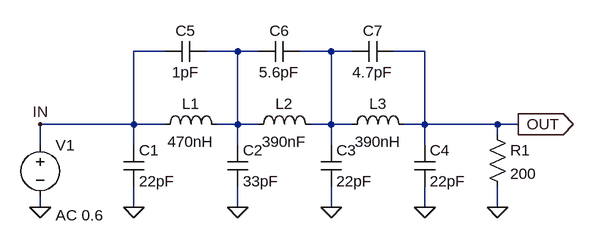
[diagram p0: schematic AD8933_3rdLPF.asc]
AD8933_3rdLPF.asc, the LTspice schematic file:
Version 4
SHEET 1 980 680
WIRE 320 0 272 0
WIRE 432 0 384 0
WIRE 464 0 432 0
WIRE 576 0 528 0
WIRE 608 0 576 0
WIRE 720 0 672 0
WIRE 272 112 272 0
WIRE 272 112 128 112
WIRE 320 112 272 112
WIRE 432 112 432 0
WIRE 432 112 400 112
WIRE 464 112 432 112
WIRE 576 112 576 0
WIRE 576 112 544 112
WIRE 608 112 576 112
WIRE 720 112 720 0
WIRE 720 112 688 112
WIRE 832 112 720 112
WIRE 864 112 832 112
WIRE 832 128 832 112
WIRE 128 144 128 112
WIRE 272 144 272 112
WIRE 432 144 432 112
WIRE 576 144 576 112
WIRE 720 144 720 112
WIRE 128 240 128 224
WIRE 272 240 272 208
WIRE 432 240 432 208
WIRE 576 240 576 208
WIRE 720 240 720 208
WIRE 832 240 832 208
FLAG 128 240 0
FLAG 272 240 0
FLAG 432 240 0
FLAG 576 240 0
FLAG 720 240 0
FLAG 832 240 0
FLAG 864 112 OUT
IOPIN 864 112 Out
FLAG 128 112 IN
SYMBOL voltage 128 128 R0
WINDOW 123 24 124 Left 2
WINDOW 39 0 0 Left 2
SYMATTR InstName V1
SYMATTR Value ""
SYMATTR Value2 AC 0.6
SYMBOL cap 256 144 R0
SYMATTR InstName C1
SYMATTR Value 22pF
SYMBOL ind 304 128 R270
WINDOW 0 32 56 VTop 2
WINDOW 3 5 56 VBottom 2
SYMATTR InstName L1
SYMATTR Value 470nH
SYMBOL cap 416 144 R0
SYMATTR InstName C2
SYMATTR Value 33pF
SYMBOL ind 448 128 R270
WINDOW 0 32 56 VTop 2
WINDOW 3 5 56 VBottom 2
SYMATTR InstName L2
SYMATTR Value 390nF
SYMBOL cap 560 144 R0
SYMATTR InstName C3
SYMATTR Value 22pF
SYMBOL cap 704 144 R0
SYMATTR InstName C4
SYMATTR Value 22pF
SYMBOL ind 592 128 R270
WINDOW 0 32 56 VTop 2
WINDOW 3 5 56 VBottom 2
SYMATTR InstName L3
SYMATTR Value 390nH
SYMBOL res 816 112 R0
SYMATTR InstName R1
SYMATTR Value 200
SYMBOL cap 384 -16 R90
WINDOW 0 0 32 VBottom 2
WINDOW 3 32 32 VTop 2
SYMATTR InstName C5
SYMATTR Value 1pF
SYMBOL cap 528 -16 R90
WINDOW 0 0 32 VBottom 2
WINDOW 3 32 32 VTop 2
SYMATTR InstName C6
SYMATTR Value 5.6pF
SYMBOL cap 672 -16 R90
WINDOW 0 0 32 VBottom 2
WINDOW 3 32 32 VTop 2
SYMATTR InstName C7
SYMATTR Value 4.7pF

The netlist it stands for:
* AD8933_3rdLPF.asc
V1 IN 0 AC 0.6
C1 IN 0 22pF
L1 IN N001 470nH
C2 N001 0 33pF
L2 N001 N002 390nF
C3 N002 0 22pF
C4 OUT 0 22pF
L3 N002 OUT 390nH
R1 OUT 0 200
C5 N001 IN 1pF
C6 N002 N001 5.6pF
C7 OUT N002 4.7pF
.backanno
.end